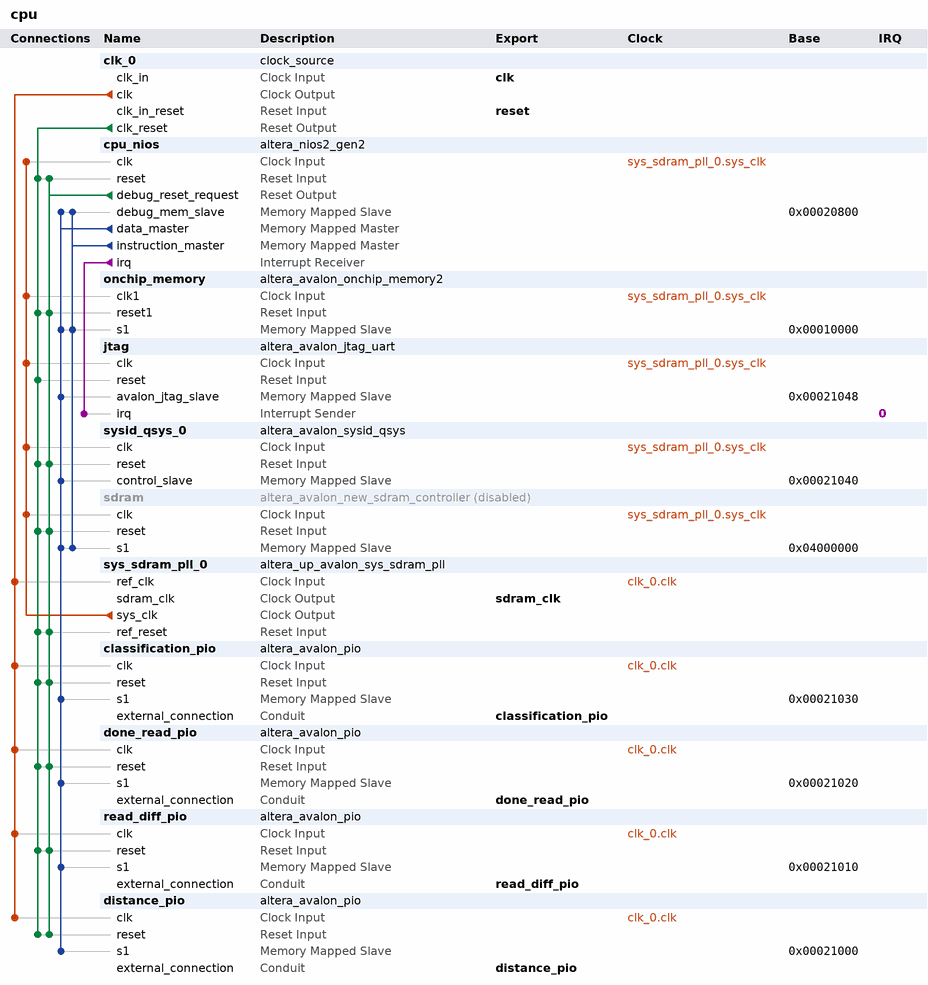
[diagram p0: system contents]
# Platform Designer (Qsys) system cpu, Cyclone V 5CSEMA5F31C6
# Parameters at their usual value, and those the tool derives, are not listed.
package require -exact qsys 17.0
create_system cpu
set_project_property DEVICE_FAMILY {Cyclone V}
set_project_property DEVICE 5CSEMA5F31C6

add_instance clk_0 clock_source 17.0
set_instance_parameter_value clk_0 clockFrequency 50000000

add_instance cpu_nios altera_nios2_gen2 17.0
set_instance_parameter_value cpu_nios dcache_size 2048
set_instance_parameter_value cpu_nios exceptionSlave onchip_memory.s1
set_instance_parameter_value cpu_nios icache_size 4096
set_instance_parameter_value cpu_nios impl Tiny
set_instance_parameter_value cpu_nios resetSlave onchip_memory.s1

add_instance onchip_memory altera_avalon_onchip_memory2 17.0
set_instance_parameter_value onchip_memory dataWidth 32
set_instance_parameter_value onchip_memory dualPort false
set_instance_parameter_value onchip_memory initMemContent true
set_instance_parameter_value onchip_memory initializationFileName onchip_mem.hex
set_instance_parameter_value onchip_memory memorySize 64000

add_instance jtag altera_avalon_jtag_uart 17.0
set_instance_parameter_value jtag simInteractiveOptions NO_INTERACTIVE_WINDOWS

add_instance sysid_qsys_0 altera_avalon_sysid_qsys 17.0
set_instance_parameter_value sysid_qsys_0 id 105

add_instance sdram altera_avalon_new_sdram_controller 17.0
set_instance_property sdram ENABLED false
set_instance_parameter_value sdram TAC 5.4
set_instance_parameter_value sdram TRCD 15.0
set_instance_parameter_value sdram TRP 15.0
set_instance_parameter_value sdram casLatency 3
set_instance_parameter_value sdram columnWidth 10
set_instance_parameter_value sdram dataWidth 16
set_instance_parameter_value sdram generateSimulationModel false
set_instance_parameter_value sdram model single_Micron_MT48LC4M32B2_7_chip
set_instance_parameter_value sdram numberOfBanks 4
set_instance_parameter_value sdram numberOfChipSelects 1
set_instance_parameter_value sdram powerUpDelay 100.0
set_instance_parameter_value sdram refreshPeriod 7.8125
set_instance_parameter_value sdram rowWidth 13

add_instance sys_sdram_pll_0 altera_up_avalon_sys_sdram_pll 17.0
set_instance_parameter_value sys_sdram_pll_0 CV_boards DE1-SoC
set_instance_parameter_value sys_sdram_pll_0 gui_outclk 50.0
set_instance_parameter_value sys_sdram_pll_0 gui_refclk 50.0

add_instance classification_pio altera_avalon_pio 17.0
set_instance_parameter_value classification_pio direction Input
set_instance_parameter_value classification_pio width 8

add_instance done_read_pio altera_avalon_pio 17.0
set_instance_parameter_value done_read_pio direction Output
set_instance_parameter_value done_read_pio width 8

add_instance read_diff_pio altera_avalon_pio 17.0
set_instance_parameter_value read_diff_pio direction Input
set_instance_parameter_value read_diff_pio width 8

add_instance distance_pio altera_avalon_pio 17.0
set_instance_parameter_value distance_pio direction Input
set_instance_parameter_value distance_pio width 32

# connections
add_connection clk_0.clk classification_pio.clk clock
add_connection clk_0.clk distance_pio.clk clock
add_connection clk_0.clk done_read_pio.clk clock
add_connection clk_0.clk read_diff_pio.clk clock
add_connection clk_0.clk sys_sdram_pll_0.ref_clk clock
add_connection sys_sdram_pll_0.sys_clk cpu_nios.clk clock
add_connection sys_sdram_pll_0.sys_clk jtag.clk clock
add_connection sys_sdram_pll_0.sys_clk onchip_memory.clk1 clock
add_connection sys_sdram_pll_0.sys_clk sdram.clk clock
add_connection sys_sdram_pll_0.sys_clk sysid_qsys_0.clk clock
add_connection clk_0.clk_reset classification_pio.reset reset
add_connection clk_0.clk_reset cpu_nios.reset reset
add_connection clk_0.clk_reset distance_pio.reset reset
add_connection clk_0.clk_reset done_read_pio.reset reset
add_connection clk_0.clk_reset jtag.reset reset
add_connection clk_0.clk_reset onchip_memory.reset1 reset
add_connection clk_0.clk_reset read_diff_pio.reset reset
add_connection clk_0.clk_reset sdram.reset reset
add_connection clk_0.clk_reset sys_sdram_pll_0.ref_reset reset
add_connection clk_0.clk_reset sysid_qsys_0.reset reset
add_connection cpu_nios.debug_reset_request classification_pio.reset reset
add_connection cpu_nios.debug_reset_request cpu_nios.reset reset
add_connection cpu_nios.debug_reset_request distance_pio.reset reset
add_connection cpu_nios.debug_reset_request done_read_pio.reset reset
add_connection cpu_nios.debug_reset_request onchip_memory.reset1 reset
add_connection cpu_nios.debug_reset_request read_diff_pio.reset reset
add_connection cpu_nios.debug_reset_request sdram.reset reset
add_connection cpu_nios.debug_reset_request sys_sdram_pll_0.ref_reset reset
add_connection cpu_nios.debug_reset_request sysid_qsys_0.reset reset
add_connection cpu_nios.data_master classification_pio.s1 avalon
set_connection_parameter_value cpu_nios.data_master/classification_pio.s1 baseAddress 0x00021030
add_connection cpu_nios.data_master cpu_nios.debug_mem_slave avalon
set_connection_parameter_value cpu_nios.data_master/cpu_nios.debug_mem_slave baseAddress 0x00020800
add_connection cpu_nios.data_master distance_pio.s1 avalon
set_connection_parameter_value cpu_nios.data_master/distance_pio.s1 baseAddress 0x00021000
add_connection cpu_nios.data_master done_read_pio.s1 avalon
set_connection_parameter_value cpu_nios.data_master/done_read_pio.s1 baseAddress 0x00021020
add_connection cpu_nios.data_master jtag.avalon_jtag_slave avalon
set_connection_parameter_value cpu_nios.data_master/jtag.avalon_jtag_slave baseAddress 0x00021048
add_connection cpu_nios.data_master onchip_memory.s1 avalon
set_connection_parameter_value cpu_nios.data_master/onchip_memory.s1 baseAddress 0x00010000
add_connection cpu_nios.data_master read_diff_pio.s1 avalon
set_connection_parameter_value cpu_nios.data_master/read_diff_pio.s1 baseAddress 0x00021010
add_connection cpu_nios.data_master sdram.s1 avalon
set_connection_parameter_value cpu_nios.data_master/sdram.s1 baseAddress 0x04000000
add_connection cpu_nios.data_master sysid_qsys_0.control_slave avalon
set_connection_parameter_value cpu_nios.data_master/sysid_qsys_0.control_slave baseAddress 0x00021040
add_connection cpu_nios.instruction_master cpu_nios.debug_mem_slave avalon
set_connection_parameter_value cpu_nios.instruction_master/cpu_nios.debug_mem_slave baseAddress 0x00020800
add_connection cpu_nios.instruction_master onchip_memory.s1 avalon
set_connection_parameter_value cpu_nios.instruction_master/onchip_memory.s1 baseAddress 0x00010000
add_connection cpu_nios.instruction_master sdram.s1 avalon
set_connection_parameter_value cpu_nios.instruction_master/sdram.s1 baseAddress 0x04000000
add_connection cpu_nios.irq jtag.irq interrupt
set_connection_parameter_value cpu_nios.irq/jtag.irq irqNumber 0

# exported interfaces
add_interface classification_pio conduit end
set_interface_property classification_pio EXPORT_OF classification_pio.external_connection
add_interface clk clock sink
set_interface_property clk EXPORT_OF clk_0.clk_in
add_interface distance_pio conduit end
set_interface_property distance_pio EXPORT_OF distance_pio.external_connection
add_interface done_read_pio conduit end
set_interface_property done_read_pio EXPORT_OF done_read_pio.external_connection
add_interface read_diff_pio conduit end
set_interface_property read_diff_pio EXPORT_OF read_diff_pio.external_connection
add_interface reset reset sink
set_interface_property reset EXPORT_OF clk_0.clk_in_reset
add_interface sdram_clk clock source
set_interface_property sdram_clk EXPORT_OF sys_sdram_pll_0.sdram_clk

set_interconnect_requirement {$system} qsys_mm.clockCrossingAdapter HANDSHAKE
set_interconnect_requirement {$system} qsys_mm.enableEccProtection FALSE
set_interconnect_requirement {$system} qsys_mm.insertDefaultSlave FALSE
set_interconnect_requirement {$system} qsys_mm.maxAdditionalLatency 1

save_system cpu.qsys
